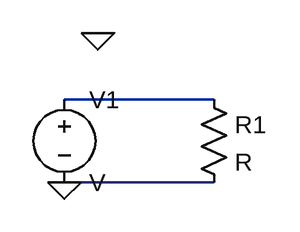
[diagram p0: schematic Draft1.asc]
Draft1.asc, the LTspice schematic file:
Version 4
SHEET 1 880 680
WIRE 112 64 -32 64
WIRE 112 144 -32 144
FLAG -32 144 0
FLAG 0 0 0
SYMBOL res 96 48 R0
SYMATTR InstName R1
SYMBOL voltage -32 48 R0
SYMATTR InstName V1

The netlist it stands for:
* Draft1.asc
R1 N001 0 R
V1 N001 0 V
.backanno
.end